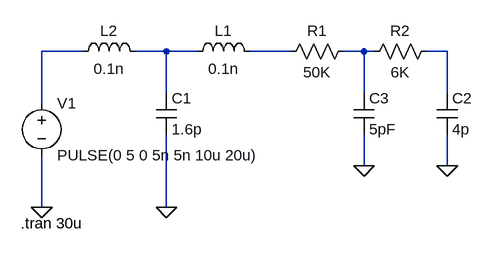
[diagram p0: schematic LED Driver.asc]
LED Driver.asc, the LTspice schematic file:
Version 4
SHEET 1 880 680
WIRE -32 64 -96 64
WIRE 96 64 48 64
WIRE 144 64 96 64
WIRE 288 64 224 64
WIRE 400 64 368 64
WIRE 416 64 400 64
WIRE 528 64 496 64
WIRE 96 128 96 64
WIRE 400 128 400 64
WIRE 528 128 528 64
WIRE -96 144 -96 64
WIRE 400 240 400 192
WIRE 528 240 528 192
WIRE -96 304 -96 224
WIRE 96 304 96 192
FLAG -96 304 0
FLAG 96 304 0
FLAG 528 240 0
FLAG 400 240 0
SYMBOL ind 128 80 R270
WINDOW 0 32 56 VTop 2
WINDOW 3 5 56 VBottom 2
SYMATTR InstName L1
SYMATTR Value 0.1n
SYMBOL voltage -96 128 R0
WINDOW 123 0 0 Left 2
WINDOW 39 24 124 Left 2
SYMATTR InstName V1
SYMATTR Value PULSE(0 5 0 5n 5n 10u 20u)
SYMBOL cap 80 128 R0
SYMATTR InstName C1
SYMATTR Value 1.6p
SYMBOL ind -48 80 R270
WINDOW 0 32 56 VTop 2
WINDOW 3 5 56 VBottom 2
SYMATTR InstName L2
SYMATTR Value 0.1n
SYMBOL cap 512 128 R0
SYMATTR InstName C2
SYMATTR Value 4p
SYMBOL res 384 48 R90
WINDOW 0 0 56 VBottom 2
WINDOW 3 32 56 VTop 2
SYMATTR InstName R1
SYMATTR Value 50K
SYMBOL cap 384 128 R0
SYMATTR InstName C3
SYMATTR Value 5pF
SYMBOL res 512 48 R90
WINDOW 0 0 56 VBottom 2
WINDOW 3 32 56 VTop 2
SYMATTR InstName R2
SYMATTR Value 6K
TEXT -128 328 Left 2 !.tran 30u

The netlist it stands for:
* LED Driver.asc
L1 N002 N003 0.1n
V1 N001 0 PULSE(0 5 0 5n 5n 10u 20u)
C1 N002 0 1.6p
L2 N001 N002 0.1n
C2 N005 0 4p
R1 N004 N003 50K
C3 N004 0 5pF
R2 N005 N004 6K
.tran 30u
.backanno
.end